# EAGLE board sd2snes19 (EAGLE 4.15), part 1 of 2
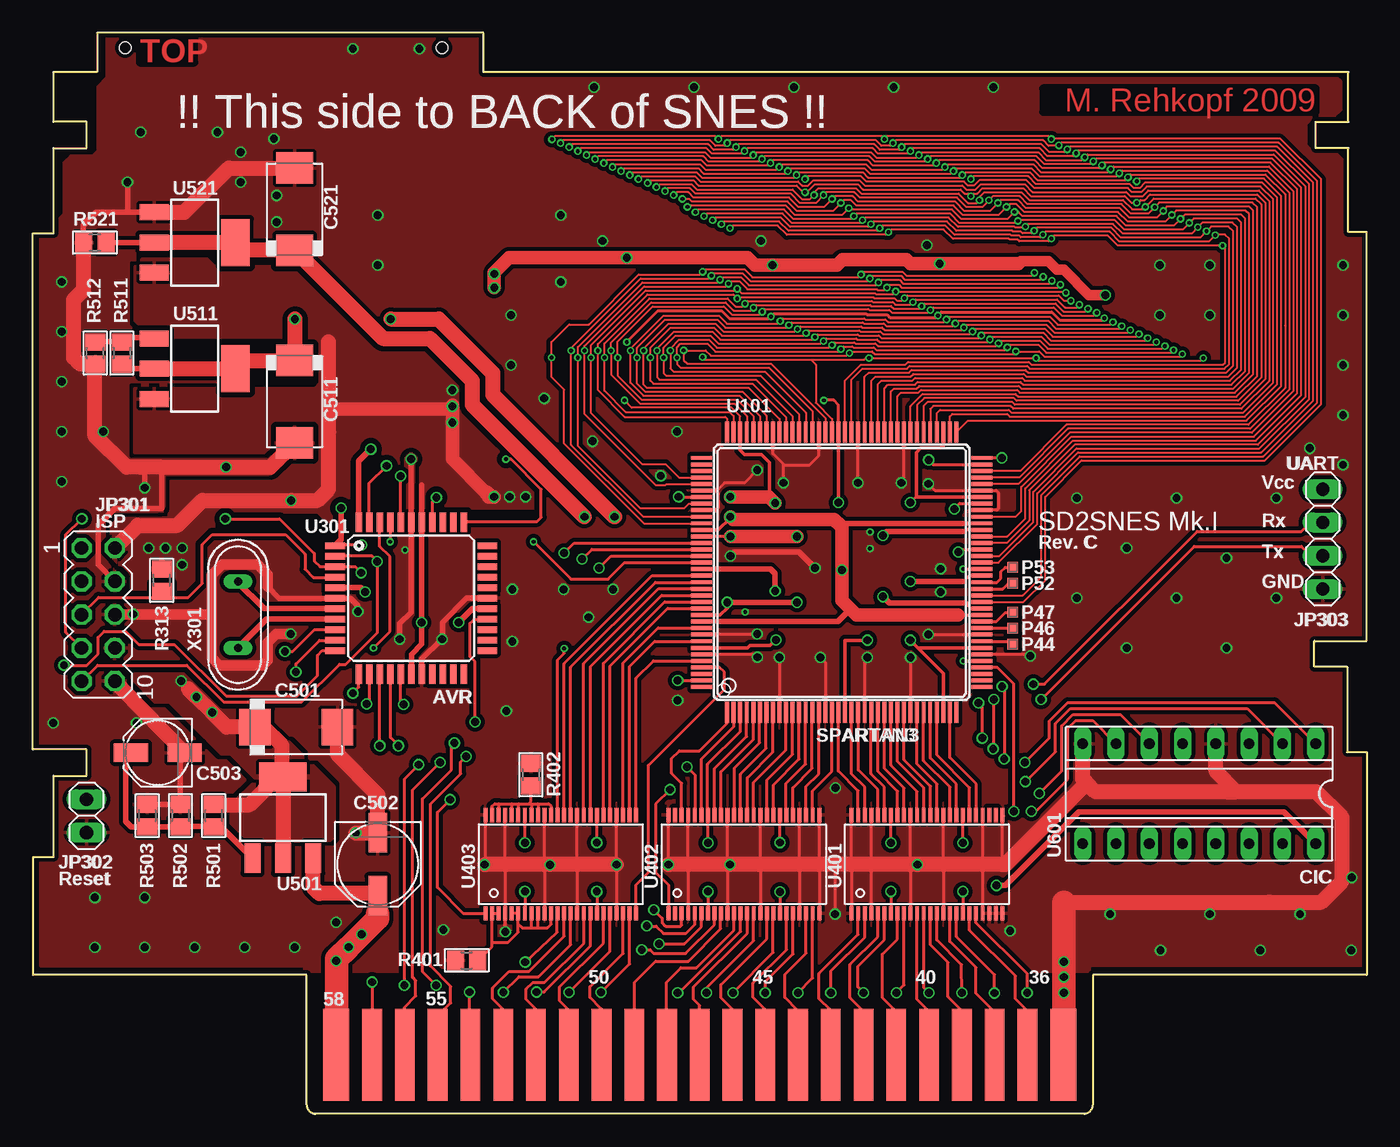
[diagram p4: board, top side]
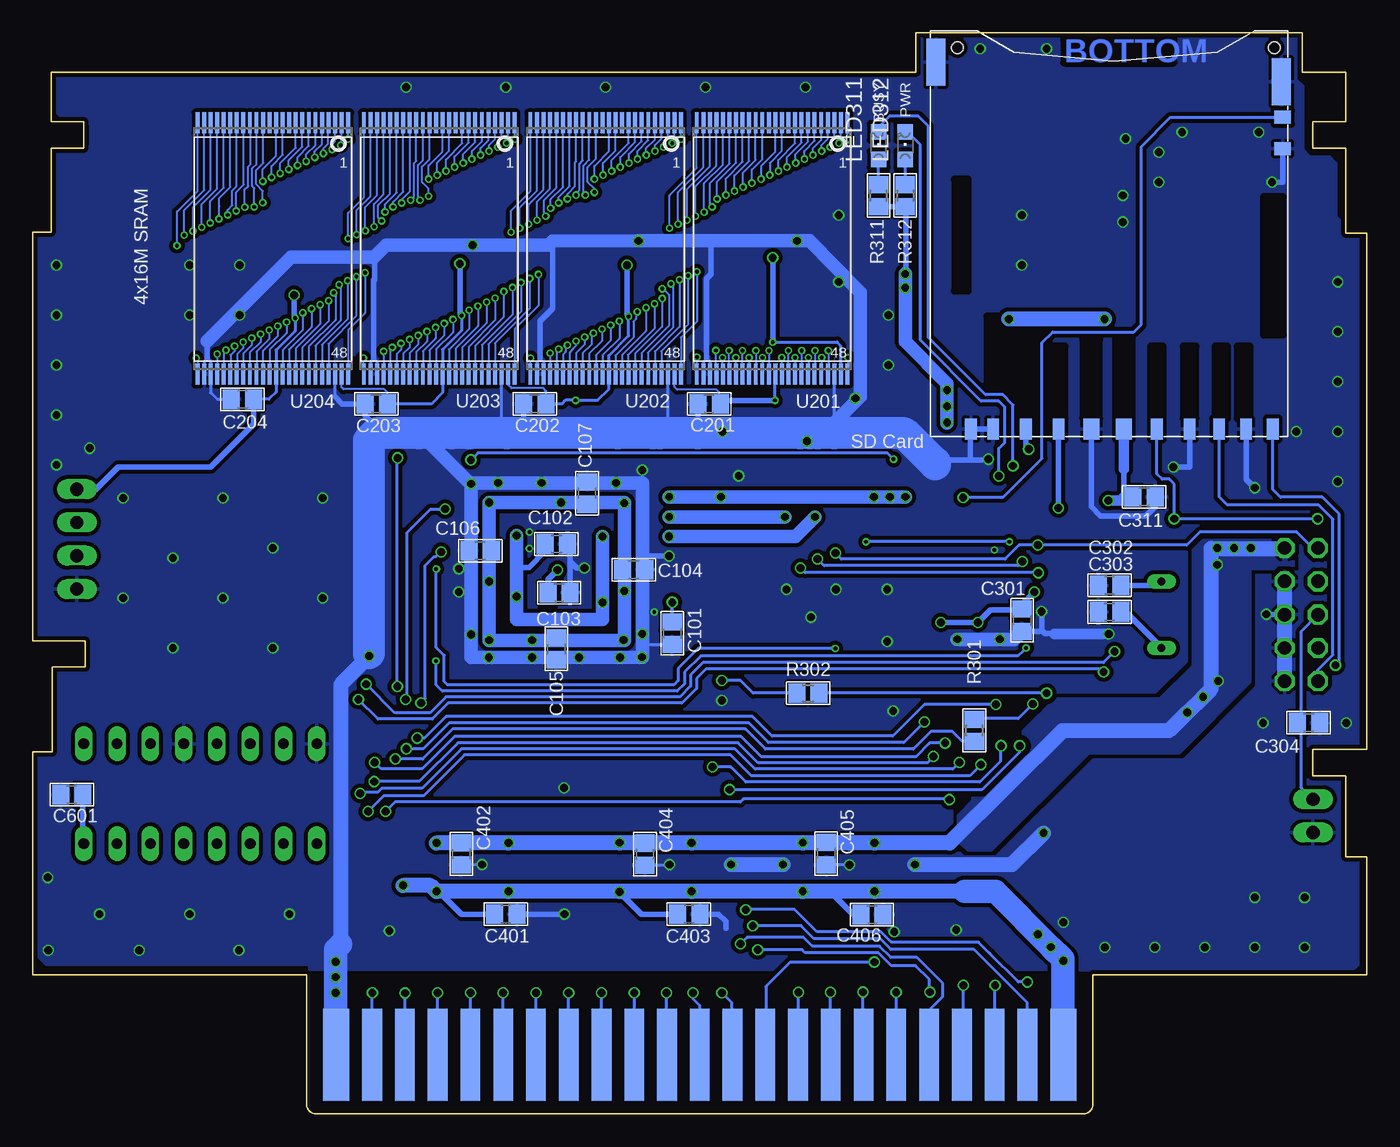
[diagram p5: board, bottom side, seen from below]

Size 101.8 x 82.5 mm. Coordinates in mm from the lower left corner, seen from the top.
Copper layers (1*16): Top 0.035mm / dielectric 1mm / Bottom 0.035mm
Design rules "myBilex DRU": minimum track width 0.15mm, minimum drill 0.3mm, track to track 0.15mm, track to pad 0.15mm, pad to pad 0.15mm, via to via 0.15mm, smd to smd 0.15mm, copper to edge 10mil, drill to drill 8mil, minimum pad ring 10mil, minimum via ring 5mil, stop-mask expansion 4mil, vias tented up to drill 0mil, thermal gap 10mil

## Footprints (pad centres in the part's own frame; a part is rotated, then mirrored left to right if it is on the bottom)
C0805 = smd 1.3 x 1.5: 1 -0.85,0; 2 0.85,0
SMC_D = smd 2.4 x 2.8: + -3.15,0; - 3.15,0
PANASONIC_D = smd 3 x 1.4: + 2.4,0; - -2.4,0
PANASONIC_C = smd 2.6 x 1.4: + 2.05,0; - -2.05,0
JAE-SG5S009V1A = smd 0.9 x 1.6: 1 6.875,14.44; 2 4.375,14.44; 5 -3.125,14.44; 6 -5.625,14.44; 7 -7.875,14.44; 8 -9.925,14.44; 9 9.375,14.44; CARD_DET1 -11.975,14.44; CARD_DET2 11.075,14.44 | smd 1.2 x 1.6: 3 1.875,14.44; 4 -0.6,14.44 | smd 1.45 x 3.6: GND -12.625,-12.06; GND@1 13.725,-13.56 | smd 1.25 x 1: WP_1 -12.725,-9.36; WP_2 -12.725,-6.96 | hole 0.9: -12.1,-14.66; 12.1,-14.66
MA05-2 = drill 1.016 octagon: 1 -5.08,-1.27; 2 -5.08,1.27; 3 -2.54,-1.27; 4 -2.54,1.27; 5 0,-1.27; 6 0,1.27; 7 2.54,-1.27; 8 2.54,1.27; 9 5.08,-1.27; 10 5.08,1.27
1X02 = drill 1.016 long: 1 -1.27,0; 2 1.27,0
1X04 = drill 1.016 long: 1 -3.81,0; 2 -1.27,0; 3 1.27,0; 4 3.81,0
CHIPLED_0805 = smd 1.2 x 1.2: A 0,-1.05; C 0,1.05
SMD08S = smd 0.8 x 0.8: PAD 0,0
R0805 = smd 1.3 x 1.5: 1 -0.85,0; 2 0.85,0
TQ144 = smd 1.6 x 0.3: P1 -10.7,8.75; P2 -10.7,8.25; P3 -10.7,7.75; P4 -10.7,7.25; P5 -10.7,6.75; P6 -10.7,6.25; P7 -10.7,5.75; P8 -10.7,5.25; P9 -10.7,4.75; P10 -10.7,4.25; P11 -10.7,3.75; P12 -10.7,3.25; P13 -10.7,2.75; P14 -10.7,2.25; P15 -10.7,1.75; P16 -10.7,1.25; P17 -10.7,0.75; P18 -10.7,0.25; P19 -10.7,-0.25; P20 -10.7,-0.75; P21 -10.7,-1.25; P22 -10.7,-1.75; P23 -10.7,-2.25; P24 -10.7,-2.75; P25 -10.7,-3.25; P26 -10.7,-3.75; P27 -10.7,-4.25; P28 -10.7,-4.75; P29 -10.7,-5.25; P30 -10.7,-5.75; P31 -10.7,-6.25; P32 -10.7,-6.75; P33 -10.7,-7.25; P34 -10.7,-7.75; P35 -10.7,-8.25; P36 -10.7,-8.75; P73 10.7,-8.75; P74 10.7,-8.25; P75 10.7,-7.75; P76 10.7,-7.25; P77 10.7,-6.75; P78 10.7,-6.25; P79 10.7,-5.75; P80 10.7,-5.25; P81 10.7,-4.75; P82 10.7,-4.25; P83 10.7,-3.75; P84 10.7,-3.25; P85 10.7,-2.75; P86 10.7,-2.25; P87 10.7,-1.75; P88 10.7,-1.25; P89 10.7,-0.75; P90 10.7,-0.25; P91 10.7,0.25; P92 10.7,0.75; P93 10.7,1.25; P94 10.7,1.75; P95 10.7,2.25; P96 10.7,2.75; P97 10.7,3.25; P98 10.7,3.75; P99 10.7,4.25; P100 10.7,4.75; P101 10.7,5.25; P102 10.7,5.75; P103 10.7,6.25; P104 10.7,6.75; P105 10.7,7.25; P106 10.7,7.75; P107 10.7,8.25; P108 10.7,8.75 | smd 0.3 x 1.6: P37 -8.75,-10.7; P38 -8.25,-10.7; P39 -7.75,-10.7; P40 -7.25,-10.7; P41 -6.75,-10.7; P42 -6.25,-10.7; P43 -5.75,-10.7; P44 -5.25,-10.7; P45 -4.75,-10.7; P46 -4.25,-10.7; P47 -3.75,-10.7; P48 -3.25,-10.7; P49 -2.75,-10.7; P50 -2.25,-10.7; P51 -1.75,-10.7; P52 -1.25,-10.7; P53 -0.75,-10.7; P54 -0.25,-10.7; P55 0.25,-10.7; P56 0.75,-10.7; P57 1.25,-10.7; P58 1.75,-10.7; P59 2.25,-10.7; P60 2.75,-10.7; P61 3.25,-10.7; P62 3.75,-10.7; P63 4.25,-10.7; P64 4.75,-10.7; P65 5.25,-10.7; P66 5.75,-10.7; P67 6.25,-10.7; P68 6.75,-10.7; P69 7.25,-10.7; P70 7.75,-10.7; P71 8.25,-10.7; P72 8.75,-10.7; P109 8.75,10.7; P110 8.25,10.7; P111 7.75,10.7; P112 7.25,10.7; P113 6.75,10.7; P114 6.25,10.7; P115 5.75,10.7; P116 5.25,10.7; P117 4.75,10.7; P118 4.25,10.7; P119 3.75,10.7; P120 3.25,10.7; P121 2.75,10.7; P122 2.25,10.7; P123 1.75,10.7; P124 1.25,10.7; P125 0.75,10.7; P126 0.25,10.7; P127 -0.25,10.7; P128 -0.75,10.7; P129 -1.25,10.7; P130 -1.75,10.7; P131 -2.25,10.7; P132 -2.75,10.7; P133 -3.25,10.7; P134 -3.75,10.7; P135 -4.25,10.7; P136 -4.75,10.7; P137 -5.25,10.7; P138 -5.75,10.7; P139 -6.25,10.7; P140 -6.75,10.7; P141 -7.25,10.7; P142 -7.75,10.7; P143 -8.25,10.7; P144 -8.75,10.7
TSOP48 = smd 0.3 x 1.6: 1 -5.75,-9.6; 2 -5.25,-9.6; 3 -4.75,-9.6; 4 -4.25,-9.6; 5 -3.75,-9.6; 6 -3.25,-9.6; 7 -2.75,-9.6; 8 -2.25,-9.6; 9 -1.75,-9.6; 10 -1.25,-9.6; 11 -0.75,-9.6; 12 -0.25,-9.6; 13 0.25,-9.6; 14 0.75,-9.6; 15 1.25,-9.6; 16 1.75,-9.6; 17 2.25,-9.6; 18 2.75,-9.6; 19 3.25,-9.6; 20 3.75,-9.6; 21 4.25,-9.6; 22 4.75,-9.6; 23 5.25,-9.6; 24 5.75,-9.6; 25 5.75,9.6; 26 5.25,9.6; 27 4.75,9.6; 28 4.25,9.6; 29 3.75,9.6; 30 3.25,9.6; 31 2.75,9.6; 32 2.25,9.6; 33 1.75,9.6; 34 1.25,9.6; 35 0.75,9.6; 36 0.25,9.6; 37 -0.25,9.6; 38 -0.75,9.6; 39 -1.25,9.6; 40 -1.75,9.6; 41 -2.25,9.6; 42 -2.75,9.6; 43 -3.25,9.6; 44 -3.75,9.6; 45 -4.25,9.6; 46 -4.75,9.6; 47 -5.25,9.6; 48 -5.75,9.6
TQFP44 = smd 1.5 x 0.5: 1 -5.8,4; 2 -5.8,3.2; 3 -5.8,2.4; 4 -5.8,1.6; 5 -5.8,0.8; 6 -5.8,0; 7 -5.8,-0.8; 8 -5.8,-1.6; 9 -5.8,-2.4; 10 -5.8,-3.2; 11 -5.8,-4; 23 5.8,-4; 24 5.8,-3.2; 25 5.8,-2.4; 26 5.8,-1.6; 27 5.8,-0.8; 28 5.8,0; 29 5.8,0.8; 30 5.8,1.6; 31 5.8,2.4; 32 5.8,3.2; 33 5.8,4 | smd 0.5 x 1.5: 12 -4,-5.8; 13 -3.2,-5.8; 14 -2.4,-5.8; 15 -1.6,-5.8; 16 -0.8,-5.8; 17 0,-5.8; 18 0.8,-5.8; 19 1.6,-5.8; 20 2.4,-5.8; 21 3.2,-5.8; 22 4,-5.8; 34 4,5.8; 35 3.2,5.8; 36 2.4,5.8; 37 1.6,5.8; 38 0.8,5.8; 39 0,5.8; 40 -0.8,5.8; 41 -1.6,5.8; 42 -2.4,5.8; 43 -3.2,5.8; 44 -4,5.8
TSSOP48 = smd 0.3 x 1.1: 1 -5.75,-3.75; 2 -5.25,-3.75; 3 -4.75,-3.75; 4 -4.25,-3.75; 5 -3.75,-3.75; 6 -3.25,-3.75; 7 -2.75,-3.75; 8 -2.25,-3.75; 9 -1.75,-3.75; 10 -1.25,-3.75; 11 -0.75,-3.75; 12 -0.25,-3.75; 13 0.25,-3.75; 14 0.75,-3.75; 15 1.25,-3.75; 16 1.75,-3.75; 17 2.25,-3.75; 18 2.75,-3.75; 19 3.25,-3.75; 20 3.75,-3.75; 21 4.25,-3.75; 22 4.75,-3.75; 23 5.25,-3.75; 24 5.75,-3.75; 25 5.75,3.75; 26 5.25,3.75; 27 4.75,3.75; 28 4.25,3.75; 29 3.75,3.75; 30 3.25,3.75; 31 2.75,3.75; 32 2.25,3.75; 33 1.75,3.75; 34 1.25,3.75; 35 0.75,3.75; 36 0.25,3.75; 37 -0.25,3.75; 38 -0.75,3.75; 39 -1.25,3.75; 40 -1.75,3.75; 41 -2.25,3.75; 42 -2.75,3.75; 43 -3.25,3.75; 44 -3.75,3.75; 45 -4.25,3.75; 46 -4.75,3.75; 47 -5.25,3.75; 48 -5.75,3.75
SOT223 = smd 1.219 x 2.235: 1 -2.311,-3.099; 2 0,-3.099; 3 2.311,-3.099 | smd 3.6 x 2.2: TAB 0,3.099
SOCKED-16 = drill 0.813 long: 1 -8.89,-3.81; 2 -6.35,-3.81; 3 -3.81,-3.81; 4 -1.27,-3.81; 5 1.27,-3.81; 6 3.81,-3.81; 7 6.35,-3.81; 8 8.89,-3.81; 9 8.89,3.81; 10 6.35,3.81; 11 3.81,3.81; 12 1.27,3.81; 13 -1.27,3.81; 14 -3.81,3.81; 15 -6.35,3.81; 16 -8.89,3.81
SNESCART = smd 2 x 7: 5 -27.75,-0.5; 27 27.75,-0.5 | smd 1.5 x 7: 6 -25,-0.5; 7 -22.5,-0.5; 8 -20,-0.5; 9 -17.5,-0.5; 10 -15,-0.5; 11 -12.5,-0.5; 12 -10,-0.5; 13 -7.5,-0.5; 14 -5,-0.5; 15 -2.5,-0.5; 16 0,-0.5; 17 2.5,-0.5; 18 5,-0.5; 19 7.5,-0.5; 20 10,-0.5; 21 12.5,-0.5; 22 15,-0.5; 23 17.5,-0.5; 24 20,-0.5; 25 22.5,-0.5; 26 25,-0.5 | smd 2 x 7 bottom: 36 -27.75,-0.5; 58 27.75,-0.5 | smd 1.5 x 7 bottom: 37 -25,-0.5; 38 -22.5,-0.5; 39 -20,-0.5; 40 -17.5,-0.5; 41 -15,-0.5; 42 -12.5,-0.5; 43 -10,-0.5; 44 -7.5,-0.5; 45 -5,-0.5; 46 -2.5,-0.5; 47 0,-0.5; 48 2.5,-0.5; 49 5,-0.5; 50 7.5,-0.5; 51 10,-0.5; 52 12.5,-0.5; 53 15,-0.5; 54 17.5,-0.5; 55 20,-0.5; 56 22.5,-0.5; 57 25,-0.5
QS = drill 0.61 long: 1 -2.54,0; 2 2.54,0

## Placement (x,y rotation side)
C101  100n  [C0805]  53,36.67 270 bottom
C102  100n  [C0805]  61.84,43.48 0 bottom
C103  100n  [C0805]  61.64,39.77 0 bottom
C104  100n  [C0805]  55.95,41.52 0 bottom
C105  100n  [C0805]  61.84,35.48 270 bottom
C106  100n  [C0805]  67.66,42.97 180 bottom
C107  100n  [C0805]  59.5,47.36 90 bottom
C201  100n  [C0805]  50.18,54.17 180 bottom
C202  100n  [C0805]  63.49,54.17 180 bottom
C203  100n  [C0805]  75.58,54.17 180 bottom
C204  100n  [C0805]  85.79,54.53 180 bottom
C301  100n  [C0805]  26.3,37.66 270 bottom
C302  22p  [C0805]  19.62,40.33 0 bottom
C303  22p  [C0805]  19.62,38.3 0 bottom
C304  100n  [C0805]  4.44,29.84 0 bottom
C311  100n  [C0805]  16.98,47.08 0 bottom
C401  100n  [C0805]  65.7,15.23 0 bottom
C402  100n  [C0805]  69.1,19.83 270 bottom
C403  100n  [C0805]  51.73,15.23 0 bottom
C404  100n  [C0805]  55.08,19.8 270 bottom
C405  100n  [C0805]  41.24,19.86 90 bottom
C406  100n  [C0805]  37.76,15.21 0 bottom
C501  T_100u  [SMC_D]  20.11,29.51 0 top
C502  100u/16V  [PANASONIC_D]  26.33,19.04 270 top
C503  22u/16V  [PANASONIC_C]  9.54,27.55 180 top
C511  T_100u  [SMC_D]  19.98,54.35 270 top
C521  T_100u  [SMC_D]  19.98,69.03 90 top
C601  100n  [C0805]  98.82,24.35 180 bottom
J301  JAE-SG5S009V1A  [JAE-SG5S009V1A]  19.14,66.7 180 bottom
JP301  [MA05-2]  4.99,38.09 270 top
JP302  [1X02]  4.11,22.73 270 top
JP303  [1X04]  98.44,43.86 270 top
LED311  RED  [CHIPLED_0805]  37.25,73.88 0 bottom
LED312  GREEN  [CHIPLED_0805]  35.22,73.88 0 bottom
P44  PAD-SMD08S  [SMD08S]  74.79,35.83 0 top
P46  PAD-SMD08S  [SMD08S]  74.79,37.05 0 top
P47  PAD-SMD08S  [SMD08S]  74.79,38.27 0 top
P52  PAD-SMD08S  [SMD08S]  74.79,40.48 0 top
P53  PAD-SMD08S  [SMD08S]  74.79,41.7 0 top
R301  270  [R0805]  29.94,29.25 90 bottom
R302  270  [R0805]  42.64,32.1 0 bottom
R311  100  [R0805]  37.25,70.07 90 bottom
R312  100  [R0805]  35.22,70.07 270 bottom
R313  10k  [R0805]  9.85,40.71 90 top
R401  10k  [R0805]  33.11,11.7 0 top
R402  10k  [R0805]  38.01,25.87 270 top
R501  100  [R0805]  13.81,22.75 90 top
R502  180  [R0805]  11.27,22.75 270 top
R503  2k2  [R0805]  8.73,22.75 270 top
R511  100  [R0805]  6.8,58.06 270 top
R512  100  [R0805]  4.77,58.06 90 top
R521  100  [R0805]  4.74,66.49 0 top
U101  XC3S200TQ144TQ144  [TQ144]  61.74,41.31 90 top
U201  CY62167DV30ZXI  [TSOP48]  45.38,66.03 180 bottom
U202  CY62167DV30ZXI  [TSOP48]  58.08,66.03 180 bottom
U203  CY62167DV30ZXI  [TSOP48]  70.78,66.03 180 bottom
U204  CY62167DV30ZXI  [TSOP48]  83.48,66.03 180 bottom
U301  ATMEGA644-20AU  [TQFP44]  28.88,39.35 0 top
U401  74ALVC164245DGG  [TSSOP48]  68.24,19.04 0 top
U402  74ALVC164245DGG  [TSSOP48]  54.27,19.04 0 top
U403  74ALVC164245DGG  [TSSOP48]  40.3,19.04 0 top
U501  LM1117MPX-ADJ  [SOT223]  19.09,22.6 0 top
U511  LM1117MPX-ADJ  [SOT223]  12.36,56.86 270 top
U521  LM1117MPX-ADJ  [SOT223]  12.36,66.49 270 top
U601  CIC  [SOCKED-16]  89.02,24.43 180 top
U$98  SNESCART  [SNESCART]  50.9,5 0 bottom
X301  12MHz  [QS]  15.66,38.09 90 top

## Tracks (layer width: path | path; a pad name or v marks a point on that pad's centre or on a via)
+1.25V  (via drill 0.6)
  Top 0.229: U101.P121 v53.25,44.06 | v53,39.03 53,38.6 | U101.P49 71.58,38.56 71.16,38.98
  Top 0.254: U101.P133 52.46,38.06 53,38.6 | U101.P61 71.16,44.57 71.03,44.44
  Top 0.406: v58.31,39.03 v53,39.03 | 71.03,44.44 65.19,44.44 v64.89,44.14 | 71.16,38.98 65.37,38.98 v64.89,39.46 | U521.2 R521.2
  Top 1.016: v53.25,44.06 v58.31,44.06
  Top 1.143: 20.01,65.91 20,65.91 C521.+ | C521.+ 19.96,65.91 19.96,65.96 16,65.96 U521.TAB 15.44,66.52 9.28,66.52 U521.2 | C521.+ 19.98,65.98 | 19.95,65.85 19.93,65.85 | C521.+ 19.95,65.85 | 19.95,65.85 20.97,65.85 | C521.+ 20.02,65.88 26.73,59.17 30.32,59.17 33.54,55.95 33.54,54.12 v42.1,45.56
  Bottom 0.229: C101.1 53,37.66 | 64.89,44.11 v64.89,44.14 | 64.89,41.7 64.91,41.7
  Bottom 0.254: v53,39.03 C101.1
  Bottom 0.406: C102.1 62.69,42.93 63.92,41.7 64.89,41.7
  Bottom 1.016: 43.81,44.06 v53.25,44.06 | v58.31,44.06 v58.31,39.03 58.31,37.74 64.89,37.74 v64.89,39.46 64.89,41.7 64.89,44.11 | 43.81,44.06 43.78,44.06 | v42.1,45.56 43.6,44.06 43.81,44.06
+2.5V  (via drill 0.6)
  Top 0.229: v53.23,45.56 53.23,45.48 | U101.P48 70.58,38.06 70.58,38.07 | 61.64,44.87 61.82,45.06
  Top 0.254: U101.P120 52.31,44.56 53.23,45.48 | U101.P134 51.45,37.56 52.27,37.56 | U101.P62 72.46,45.05 | U101.P62 | 71.21,45.05 U101.P62
  Top 0.406: 62.41,38.51 61.46,37.56 52.27,37.56 | 61.76,41.52 61.79,41.52 v61.76,41.5 | R511.2 7.12,56.89 9.19,56.86 | 61.82,45.06 61.84,45.05 71.21,45.05
  Top 1.016: v53.23,45.56 53.43,45.36 61.15,45.36 61.64,44.87 61.76,44.75 61.76,41.52 61.76,39.16 62.41,38.51 62.86,38.07 70.58,38.07 70.6,38.07
  Top 1.143: U511.2 9.19,56.86 U511.TAB 16.07,57.47 20.01,57.47 C511.+ 20.01,57.52 v20.01,60.65 | v27.31,60.65 30.98,60.65 35.09,56.53 35.09,54.88 44.42,45.56 v44.39,45.56
  Bottom 0.406: C103.1 62.49,40.77 v61.76,41.5
  Bottom 1.016: v44.39,45.56 v53.23,45.56
  Bottom 1.143: v20.01,60.65 v27.31,60.65
+3V3  (via drill 0.3, 0.6)
  Top 0.152: v45.15,54.45 45.71,53.89 53.33,53.89 53.99,53.24 U101.P106
  Top 0.229: U101.P3 53.99,30.62 | U101.P3 | U101.P3 53.99,29.18 51.5,26.69 51.5,22.81 U402.42 51.52,20.75 v51.53,20.67 | U403.42 37.55,20.75 v37.56,20.67 | U403.31 v43.05,20.7 v43.04,20.69 | U402.31 v57.02,20.7 v57.01,20.69 | U401.31 v70.98,20.67 | U401.42 v65.5,20.67 | 61.99,36.14 61.99,36.13 | v66.97,36.14 67.54,35.56 | U101.P54 71.49,41.06 71.06,40.63 | v66.97,46.65 67.38,47.06 67.43,47.06 | v61.48,46.65 61.49,46.63 | 56.2,47.06 56.23,47.08 | U101.P115 49.29,47.06 v49.29,47.08 | U101.P91 61.49,52.14 61.48,52.14 61.48,54.09 61.13,54.45 v60.37,54.45 | 56.3,60.83 56.12,60.65 53.2,60.65 52.59,61.26 47.69,61.26 v45.33,58.9 | v56.33,60.85 56.3,60.83 | 56.3,60.83 56.53,61.05 63.62,61.05 63.69,60.98 65.22,60.98 65.42,60.77 68.93,60.77 v69.08,60.93 69.33,61.18 77.77,61.18 78.38,60.57 81.63,60.57 v81.78,60.72
  Top 0.254: U101.P138 54.56,35.56 54.73,35.73 56.28,35.73 v56.71,36.16 | 61.99,36.13 U101.P19 | v63.69,36.14 61.99,36.14 | U101.P34 69.49,33.62 v66.97,36.14 | 67.54,35.56 U101.P43 | U101.P66 67.43,47.06 67.43,50.46 67.76,50.79 69.28,50.79 69.49,51 69.49,51.94 U101.P75 | 61.49,46.63 U101.P91 | U101.P106 53.99,50.64 54.32,50.31 55.62,50.31 56.23,49.7 56.23,47.08 | U101.P126 52.16,41.57
  Top 0.406: v66.97,40.63 71.06,40.63 | v35.2,47.08 35.2,47.11 | 28.9,33.53 28.9,33.24 | 28.9,33.53 U301.17 | 28.9,33.53 28.9,35.07 29.68,35.86 v29.68,37.48 v29.68,37.49 U301.38 29.68,46.5 29.68,48 | U301.5 25.04,40.15 v25.37,39.82 | U301.27 33.57,38.55 v32.5,37.48 | 52.16,41.57 56.3,41.57 56.66,41.22 v56.66,39.9
  Top 0.813: 75.23,64.89 75.4,65.07 77.51,65.07 78.17,64.41 78.68,64.41 80.61,62.48 v81.85,62.48
  Top 1.016: 34.64,47.44 34.67,47.35 34.79,47.08 v35.2,47.08 | v53.23,47.08 56.18,47.08 56.2,47.06 | 56.2,47.06 56.53,46.73 | 56.2,47.06 v56.66,46.6 | v35.22,63.04 v35.22,64.1 35.22,64.2 36.36,65.35 v45.33,65.35 54.55,65.35 55.13,64.76 v56.45,64.76 61.38,64.76 61.79,65.17 66.69,65.17 67,64.89 v69.21,64.89 75.23,64.89 | 22.57,53.79 32.02,53.79 | 32.02,53.79 32.02,54.09 | 34.64,47.34 32.02,49.95 32.02,53.79
  Top 1.143: U501.TAB U501.2 | 13.8,23.59 13.71,23.59 | R501.2 13.8,23.59 | 13.8,23.59 16.55,23.59 18.66,25.7 U501.TAB | JP301.2 7.99,44.9 11.04,44.9 12.94,46.8 v19.73,46.8 21.73,46.8 22.57,47.64 22.57,52.11 | 22.57,52.11 22.57,51.96 | U511.3 | 22.57,52.11 22.57,53.79 22.57,58.9 | U501.TAB 19.02,25.7 19.02,28.1 17.63,29.48 16.98,29.48 C501.+ 14.79,29.51 v13.68,30.62 v12.49,31.82 11.88,32.43 | U501.TAB | 34.64,47.34 34.65,47.35 34.67,47.35
  Bottom 0.152: 45.15,56.48 45.13,56.46 U201.37 | U202.47 52.82,56.4 52.82,55.47 52.62,55.26 49.62,55.26 49.39,55.03 49.39,54.42 49.41,54.41 C201.1 | U203.47 65.53,55.63 65.27,55.36 62.83,55.36 62.63,55.16 62.63,54.17 | U204.47 78.23,55.42 78.1,55.29 74.97,55.29 74.74,55.06 74.74,54.2 74.73,54.18 C203.1
  Bottom 0.229: 43.04,20.67 v43.04,20.69 | 39.51,20.67 39.51,20.72 39.53,20.71 C405.2 | 57.01,20.67 v57.01,20.69 57.04,20.69 57,20.65 C404.1 | C402.1 69.12,20.67 v70.98,20.67 | 56.66,36.19 56.71,36.19 v56.71,36.16 | 66.97,36.24 66.92,36.24 v66.97,36.14 | v66.97,40.63 66.95,40.63 66.81,40.77 C106.1 | v66.97,46.65 66.87,46.63 | 61.46,46.65 61.46,46.63 v61.48,46.65 | 49.24,47.08 49.24,47.06 v49.29,47.08 | 56.66,43.1 56.68,43.1 56.68,42.87 | C104.1 56.68,41.63 56.68,42.87 | 56.66,42.87 56.68,42.87 | 45.15,56.48 v45.15,54.45 45.13,54.42 | v56.33,60.85 56.33,59.38 57.83,57.88 U202.37 57.83,55.31 58.69,54.45 v60.37,54.45 | v45.33,58.9 40.43,58.9 40.15,58.62 40.15,56.43 U201.47 | v69.08,60.93 69.08,59.78 70.53,58.33 U203.37 70.53,55.03 71.36,54.17 C203.1 | U204.37 83.23,58.29 81.78,59.73 v81.78,60.72 | 49.33,54.37 46.85,54.42 | 49.33,54.37 C201.1 | 49.39,54.42 49.33,54.37 | U204.37 83.25,56.41 83.23,56.38 | C204.1 83.79,54.53 83.23,55.09 83.23,56.33 83.25,56.36 83.23,56.38 U204.37 | 62.63,54.17 61.41,54.17 61.13,54.45 v60.37,54.45 | v60.37,54.45 60.32,54.45 | 35.17,69.21 37.25,69.21 | v35.22,64.1 35.17,64.15
  Bottom 0.406: v25.37,39.82 25.37,39.85 26.33,38.88 26.33,38.49 | 26.33,38.45 26.33,38.4 | 26.33,38.49 26.33,38.45 | 26.33,38.49 C301.1 | 26.33,38.45 28.72,38.45 v29.68,37.48 v32.5,37.48 | 45.13,54.42 49.39,54.42 | 62.63,54.17 C202.1 | 81.85,62.45 81.85,60.72 v81.78,60.72 | v69.21,64.89 69.21,61.05 v69.08,60.93 | v56.45,64.76 56.45,60.98 v56.33,60.85 | v45.33,65.35 v45.33,58.9 | C204.1 84.95,54.51 84.95,52.65 88.23,49.37 95.29,49.37 97.04,47.62 98.47,47.62 98.47,47.64 JP303.1 | 18.53,47.08 18.56,47.08 | 18.53,47.08 C311.1 | 18.53,47.08 18.53,49.22 | R312.2 R311.1 37.25,69.21 | 35.17,64.15 35.17,69.21
  Bottom 0.813: v19.73,46.8 18.53,46.8 18.53,47.08 | 18.53,49.22 J301.4
  Bottom 1.016: v35.2,47.08 v36.39,47.08 v37.61,47.08 49.24,47.08 v53.23,47.08 | v56.66,46.6 56.66,43.1 56.66,42.87 v56.66,39.9 56.66,36.19 56.66,36.14 60.47,36.14 | 60.47,36.14 v63.69,36.14 v66.97,36.14 66.97,36.24 v66.97,40.63 v66.97,46.65 61.46,46.65 60.72,46.65 | 60.72,46.65 56.63,46.65 | C107.1 59.5,46.65 60.72,46.65 | C105.1 61.84,36.14 60.47,36.14 | v35.22,64.1 v35.22,63.04 35.22,58.92 32.02,55.72 32.02,55.06 | 32.02,55.36 v32.02,55.24 32.02,55.06 | v32.02,52.75 v32.02,53.99 32.02,54.3 | 32.02,55.06 32.02,54.3 | v32.02,52.75 32.02,52.7 | 32.02,54.3 v32.02,52.75
  Bottom 1.143: v70.98,20.67 v65.5,20.67 57.01,20.67 v51.53,20.67 43.04,20.67 39.51,20.67 v37.56,20.67 31.84,20.67 23.23,29.23 15.1,29.23 v13.68,30.62 v12.49,31.82 11.88,32.43 11.88,43.15 6.24,43.15 | 6.24,43.15 6.16,43.15 | 6.24,43.15 JP301.2
  other vias: 11.32,33.04 10.12,43.17 11.39,41.9 11.39,43.17 8.85,43.17
  pour Top (isolate 0.406): 27.09,45.26 28.08,46.25 39.21,46.25 39.36,46.4 39.36,47.57 38.83,48.1 38.01,48.1 32.63,53.48 32.63,58.13 31.33,59.43 26.76,59.43 21.96,64.23 21.55,64.66 13.91,64.66 13.35,65.22 8.32,65.22 7.79,64.69 7.79,60.52 9.03,59.28 20.67,59.28 21.05,58.89 21.91,58.06 21.91,55.75 21.5,55.34 7.74,55.34 7.74,50.46 8.02,50.18 17.44,50.18 18.41,51.15 21.2,51.15 21.76,50.59 21.76,45.89 22.39,45.26
  pour Bottom (isolate 0.406): 29.96,25.29 23.69,31.56 15.71,31.56 13.17,34.1 13.17,43.15 12.39,43.93 5.68,43.93 5.65,42.99 5.68,42.18 5.68,41.67 8.98,41.67 8.98,33.01 14.39,27.6 21.3,27.6 28.97,19.93 30.14,19.93 31.08,20.87 31.08,22.75 29.96,23.87
  pour Top (isolate 0.406): 10.51,31.51 14.47,27.55 15.18,27.55 17.24,25.49 15.23,23.49 15.23,21.96 16.3,20.9 22.57,20.9 22.93,21.23 22.93,24.91 19.5,28.31 17.74,28.31 17.03,29.02 17.03,31.01 16.65,31.39 14.47,31.39 12.36,33.49 7.76,33.49 7.41,33.14 7.41,31.51
  pour Top (isolate 0.406): 6.06,42.59 6.67,41.95 6.92,41.95 7.53,41.34 7.53,40.07 7.66,39.95 11.78,39.95 12.59,40.76 12.59,43.4 14.72,45.53 14.95,45.53 15.43,46.02 22.72,46.02 22.72,49.73 19.68,49.73 18.71,48.76 11.06,48.76 10.51,48.2 10.51,45.38 6.34,45.38 6.06,45.1
+5V  (via drill 0.6)
  Top 0.229: U403.18 43.05,16.93 v43.04,16.96 | U403.7 37.55,16.9 v37.56,16.96 | U402.18 v57.02,16.93 v57.01,16.93 | U402.7 51.52,16.9 v51.53,16.96 | 65.49,16.9 v65.5,16.96 U401.7 | U401.18 70.99,16.9 v70.98,16.96
  Top 0.406: v73.55,17.42 74.23,17.42 79.85,23.03 95.47,23.03 97.91,20.59 U601.16 | U$98.27 23.16,4.44 | U$98.27 | v23.16,11.68 U$98.27
  Top 1.143: 26.31,16.67 26.31,16.81 21.86,16.81 21.4,17.26 U501.3 | 26.31,16.67 C502.+ | 26.31,15.26 26.31,15.97 | 26.31,15.97 26.31,16.67 | 26.31,15.97 26.33,15.97 26.3,15.94 | U501.3
  Top 1.778: 26.31,15.26 26.31,14.93 v24.1,12.72 23.21,11.83 23.21,10.1 | 23.17,4.5 23.21,4.46 23.21,10.1 | 23.21,10.1 23.21,10.13
  Bottom 0.229: 57.01,16.99 57.01,16.96 v57.01,16.93 | v70.98,16.96 70.98,16.99 | 43.07,16.96 43.04,16.93
  Bottom 0.406: 43.04,16.93 40.91,16.93 39.21,15.23 38.6,15.23 38.61,15.22 C406.1 | v70.98,16.96 70.98,16.83 70.69,16.83 69.08,15.23 C401.1 | v57.01,16.93 57.01,16.88 55.36,15.23 C403.1 | 24.04,12.72 24.02,12.69 | v24.1,12.72 24.04,12.72 | v25.09,13.68 25.01,13.68 24.04,12.72 | 23.21,11.7 23.16,11.7 v23.16,11.68 U$98.27 | U$98.27 23.16,4.49 | U$98.27 | U601.16 97.91,20.67 97.97,20.73 C601.1
  Bottom 1.143: 30.67,16.96 v37.56,16.96 v43.04,16.96 43.07,16.96 v51.53,16.96 57.01,16.96 v65.5,16.96 v70.98,16.96 71.44,17.42 v73.55,17.42
  Bottom 1.778: 30.67,16.96 28.34,16.96 v24.1,12.72 23.21,11.83 23.21,11.7 23.21,4.23 23.15,4.29
BANK0_CE  (via drill 0.3)
  Top 0.152: v46.22,71.34 46.42,71.54 50.54,71.54 50.94,71.14 58.41,71.14 58.72,70.83 59.17,70.83 59.58,71.24 63.08,71.24 63.49,70.83 70.93,70.83 71.24,70.53 71.95,70.53 72.36,70.93 75.71,70.93 76.29,70.35 83.46,70.35 83.76,70.05 84.73,70.05 85.13,70.45 93.56,70.45 94.35,69.66 94.35,55.92 92.24,53.82 74.82,53.82 74.62,54.02 68.72,54.02 68.49,53.78 U101.P77
  Bottom 0.152: U201.12 45.13,73.42 46.22,72.33 v46.22,71.34
BANK1_CE  (via drill 0.3)
  Top 0.152: v58.94,71.34 59.15,71.54 63.21,71.54 63.62,71.14 71.06,71.14 71.36,70.83 71.82,70.83 72.23,71.24 75.84,71.24 76.42,70.66 83.58,70.66 83.89,70.35 84.6,70.35 85,70.76 93.69,70.76 94.66,69.79 94.66,55.8 92.37,53.51 74.69,53.51 74.49,53.71 69.23,53.71 68.99,53.47 U101.P76
  Bottom 0.152: U202.12 57.83,73.45 58.94,72.33 v58.94,71.34
BANK2_CE  (via drill 0.3)
  Top 0.152: v71.59,71.34 71.8,71.54 75.96,71.54 76.55,70.96 83.71,70.96 84.01,70.66 84.47,70.66 84.88,71.06 93.82,71.06 94.96,69.92 94.96,55.67 92.5,53.21 74.57,53.21 74.36,53.41 70.17,53.41 69.99,53.22 U101.P74
  Bottom 0.152: U203.12 70.53,73.42 71.59,72.36 v71.59,71.34
BANK3_CE  (via drill 0.3)
  Top 0.152: v84.24,71.16 84.45,71.37 93.95,71.37 95.27,70.05 95.27,55.54 92.62,52.9 71.36,52.9 U101.P73
  Bottom 0.152: U204.12 83.23,73.12 84.24,72.1 v84.24,71.16
CCLK  (via drill 0.6)
  Top 0.229: U101.P72 | 72.48,50.06 U101.P72 | v74.13,27.07 74.18,27.12 74.18,32.4 v73.98,32.61 | U101.P72 v73.96,50.06
  Bottom 0.229: 29.93,28.42 29.89,28.42 | R301.1 29.93,28.42 | 29.93,28.42 30.85,28.42 31.61,29.18 33.26,29.18 34.61,27.83 45.89,27.83 47.41,29.35 69.76,29.35 72.05,27.07 v74.13,27.07 | v73.96,50.06 73.98,50.06 v73.98,32.61
CCLK_AVR  (via drill 0.6)
  Top 0.229: U301.13 25.7,33.53 25.7,31.51 v25.47,31.29
  Bottom 0.229: 30,30.17 30.06,30.17 | 30,30.17 R301.2 | v25.47,31.29 26.58,30.17 30,30.17
CLKIN  (via drill 0.3)
  Top 0.229: U301.41 27.27,45.14 v27.27,43.66 | v38.22,43.66 41.06,40.81 43.91,40.81 45.15,42.05 U101.P125 | U101.P125 51.07,42.05 | U101.P125
  Bottom 0.229: v27.27,43.66 v38.22,43.66
DIN/FPGA_SS  (via drill 0.6)
  Top 0.229: U301.26 34.67,37.74 33.67,37.74 33.37,37.43 33.37,34.89 33.75,34.51 v33.75,29.91 | U101.P65 72.43,46.58 70.73,46.58 70.3,46.14 v70.32,46.14 | v73.3,27.86 73.35,27.91 v73.35,31.62
  Bottom 0.229: v33.75,29.91 35.32,28.34 45.66,28.34 47.16,29.84 70.02,29.84 72,27.86 v73.3,27.86 73.32,27.86 | 70.3,46.14 v70.32,46.14 71.44,46.14 73.22,44.37 73.22,31.74 v73.35,31.62
DONE  (via drill 0.3, 0.6)
  Top 0.229: 72.43,49.57 U101.P71 68.71,49.56 v68.37,49.9 | U301.34 32.94,45.2 38.5,45.2 38.8,45.51 38.8,47.64 36.49,49.95 v36.11,49.95
  Bottom 0.229: v68.37,49.9 67.83,50.44 36.59,50.44 v36.11,49.95
FPGA_INT  (via drill 0.3)
  Top 0.229: U301.42 26.48,43.3 27.27,42.51 27.27,36.82 v26,35.55 | U101.P41 72.48,34.56 v71.03,34.56
  Bottom 0.229: 26.18,35.37 26.2,35.35 | 26.18,35.37 v26,35.55 | 26.18,35.37 26.61,34.94 50.82,34.94 52.06,33.7 52.06,32.81 52.62,32.25 70.55,32.25 71.03,32.73 v71.03,34.56
FPGA_P44
  Top 0.229: 74.79,35.81 74.82,35.78 | 74.79,35.81 P44.PAD | U101.P44 74.54,36.06 74.79,35.81
FPGA_P46
  Top 0.229: P46.PAD 74.82,37.05 74.81,37.06 U101.P46
FPGA_P47
  Top 0.229: U101.P47 73.53,37.56 74.21,38.24 74.79,38.24 P47.PAD
FPGA_P52
  Top 0.229: P52.PAD 74.44,40.48 74.02,40.06 U101.P52
FPGA_P53
  Top 0.229: U101.P53 73.58,40.56 73.88,40.86 73.88,41.37 74.21,41.7 P53.PAD
GND  (via drill 0.3, 0.6)
  Top 0.229: 41.55,19.02 41.55,18.99 | U403.34 41.55,19 41.55,18.99 | 39.06,19.04 39.06,19.02 39.06,18.99 39.44,18.99 | 39.06,19.04 39.06,19.07 39.05,19.07 U403.39 | 36.05,19.07 36.05,19.03 36.06,19.02 | 36.05,19.07 U403.45 | U403.48 34.55,19.03 34.53,19.02 | U403.4 | 39.06,19.04 39.11,18.99 39.44,18.99 | U403.10 39.05,19.04 39.06,19.04 | U403.15 41.55,18.99 | 41.55,18.99 41.27,18.99 41.19,19.07 39.51,19.07 39.44,18.99 | 39.44,18.99 v39.49,18.99 | v44.54,19.02 44.54,19.09 | U403.21 44.55,19.09 44.54,19.09 | U403.28 44.55,19.1 44.54,19.09 | 36.05,19.07 36.06,19.07 | 53.18,19.02 53.18,19.04 v53.2,19.02 | U402.39 53.02,19.02 53.03,19.02 | U402.48 48.52,19.03 48.53,19.02 | U402.45 50.02,19 50.03,18.99 50.03,19.02 50.02,19.01 U402.4 | U402.34 55.52,19.1 55.44,19.02 55.16,19.02 55.08,18.94 53.25,18.94 53.2,18.99 | U402.28 58.52,19.03 58.51,19.02 58.51,18.99 58.52,18.98 U402.21 | U402.25 60.02,19.03 60.01,19.02 60.02,19.01 U402.24 | U401.48 62.49,19.03 62.5,19.02 | 64,19.02 64,19.07 63.99,19.08 U401.45 | 67,19.02 67,19.09 66.99,19.1 U401.39 | 69.49,19.07 69.49,19.04 69.51,19.02 | 69.49,19.07 U401.34 | U401.28 72.49,19.03 72.48,19.02 72.48,16.4 | U401.25 73.99,19.03 73.98,19.02 | v53.2,19.02 53.2,18.99 | U402.10 53.02,18.81 53.2,18.99 | U402.15 55.52,18.66 55.08,19.09 53.23,19.09 53.15,19.02 v53.2,19.02 | 63.97,19.02 63.97,15.54 | 69.49,19.07 | 72.48,16.4 72.48,16.35 | 67.48,19.02 67.48,19.04 v67.5,19.02 67.48,18.99 | U403.4 | 36.08,19.02 36.08,18.99 36.06,18.97 | U403.4 | U101.P114 51.06,47.54 52.14,47.54 | 52.14,47.54 52.16,47.54 52.77,48.15 54.32,48.15 v55.29,49.12 | U101.P117 52.13,46.06 52.29,46.22 52.29,47.39 52.14,47.54
  Top 0.229: U101.P139 51.03,35.06 51.02,35.07 55.08,35.07 v55.31,34.84 | U101.P136 55.28,36.56 v55.29,36.62 | U101.P16 60.49,34.44 v60.11,34.82 | U101.P22 63.49,34.56 v63.69,34.82 | U101.P29 66.99,34.81 v67,34.82 | U101.P9 v56.99,34.81 v56.99,34.82 | U101.P42 76.13,35.06 v76.14,34.94 | U101.P45 v68.35,36.56 v68.34,36.57 | U101.P101 56.49,50.38 57.29,49.57 57.29,49.52 | v57.29,48.15 57.29,49.52 | U101.P94 59.99,50.23 59.27,49.52 57.29,49.52 | U101.P88 v62.98,48.15 | U101.P81 66.49,48.15 v66.28,48.15 | 72.41,47.56 68.85,47.56 68.85,47.57 | 72.41,47.56 U101.P67 73.52,47.57 73.68,47.41 73.68,46.17 73.57,46.06 U101.P64 | 72.41,47.56 72.41,47.57 68.85,47.57 | v68.34,48.07 68.85,47.57 | 36.06,19.02 36.06,19.04 | 36.06,19.02 v36.06,13.89 36.06,15.28 U403.4 | 78.68,4.54 78.65,4.54 | 62.47,19.02 62.47,18.99 62.49,18.98 U401.1 | 61.23,19.02 v61.23,15.23 | 63.97,15.54 63.97,15.31 U401.4 | 63.97,15.54 63.97,15.06 | U401.21 72.48,16.4 | U401.15 69.49,18.99 67.48,18.99 | 67.48,18.99 67.35,18.99 | U401.10 66.97,15.31 66.97,19.02
  Top 0.406: 11.24,23.58 11.24,23.54 | 11.24,23.58 R502.1 11.25,23.61 8.71,23.61 | C503.- 11.24,26.76 11.24,23.58 | 8.71,23.61 8.7,23.61 | R503.1 8.71,23.61 | 3.83,65.83 3.88,65.78 R521.1 | 7.31,68.8 7.23,68.8 v7.23,71.11 | 7.31,68.8 U521.1 | 28.87,45.13 28.88,45.14 U301.39 | 28.87,45.13 v28.87,49.95 | v59.71,41.65 58.49,42.87 53.56,42.87 v53.25,42.56 | JP301.4 4.99,41.9 4.99,44.93 6.26,46.2 9.82,46.2 9.82,49.34 | U301.6 23.07,39.34 22.65,39.34 | 22.65,39.34 18.81,39.34 17.92,40.23 | 28.87,45.13 28.87,38.27 28.01,37.41 v28.01,36.21 | U301.28 33.1,39.35 31.26,37.51 31.26,36.19 v31.23,36.21 | U301.18 29.68,34.71 31.18,36.21 v31.23,36.21 | v28.01,36.21 28.01,36.19 | v31.23,36.21 31.26,36.21 | R521.1 3.85,65.78 3.83,65.8 3.88,65.85 | 8.22,49.34 8.22,49.32 8.55,48.99 v8.55,47.77 | 22.65,39.34 24.25,39.34 24.81,38.78 v24.81,38.32 | v28.01,36.21 28.03,36.24 | C521.- 19.64,72.52 | 7.31,68.8 4.84,68.8 3.85,67.81 3.85,66.49 R521.1 | 78.68,4.5 78.68,5.3 78.65,5.3 | 78.68,8.83 78.65,8.83 78.65,5.3 | U$98.36 78.65,5.3 | 78.68,4.5 U$98.36 | 78.68,4.5 78.68,9.26 | v78.68,9.24 U$98.36
  Top 0.813: 17.92,40.23 17.92,41.14 17.16,41.9 14.44,41.9 13.66,41.12 13.66,38.12 | 13.66,38.12 13.66,34.82 14.24,34.23 17.54,34.23 17.92,34.61 17.92,35.96 18.58,36.62 v19.68,36.62 | 6.24,38.12 v7.66,38.12 13.66,38.12
  Top 1.143: 34.56,19.02 36.06,19.02 36.08,19.02 39.06,19.02 41.55,19.02 v44.54,19.02 | 48.56,19.02 50.03,19.02 53.03,19.02 53.15,19.02 53.18,19.02 v53.2,19.02 55.44,19.02 58.51,19.02 60.01,19.02 61.23,19.02 62.47,19.02 62.5,19.02 63.97,19.02 64,19.02 66.97,19.02 67,19.02 67.48,19.02 v67.5,19.02 69.51,19.02 72.48,19.02 73.98,19.02 74.21,19.02 80.43,25.24 | 78.68,4.4 78.68,4.16 | 91.08,24.58 91.86,24.58 90.29,26.15 U601.4 | U601.8 80.13,25.54 80.43,25.24 | 80.43,25.24 81.09,24.58 91.08,24.58 | 80.43,25.24 80.33,25.39 | JP301.10 6.26,32.99 6.82,32.43 C503.- | v24.65,21.43 26.32,21.43 C502.- 26.33,24.35 23.26,27.42 C501.- | 34.56,19.02 34.53,19.02 | 34.56,19.02 v34.48,19.02 | 48.56,19.02 48.53,19.02 | 48.56,19.02 v48.5,19.02 | 3.88,65.78 3.88,62.88 3.11,62.12 3.11,57.7 3.6,57.22 4.75,57.22 R512.1 4.74,57.18 4.74,51.76 7.15,49.34 8.22,49.34 9.82,49.34 v14.75,49.34 18.13,49.34 C511.- | U521.1 11.57,68.8 14.95,72.18 C521.- | 78.68,16.15 94.35,16.15 | C521.- | 91.08,24.58 97.93,24.58 99.91,22.6 99.91,17.75 98.31,16.15 94.35,16.15 | 94.35,16.15 94.38,16.15
  Top 1.778: 78.68,4.4 78.68,4.54 78.68,5.3 78.68,8.83 78.68,9.26 v78.68,10.43 v78.68,11.6 78.68,16.15
  Bottom 0.152: 57.17,51.94 57.14,51.96
  Bottom 0.229: C405.1 39.5,19.01 v39.49,18.99 | C404.2 53.27,18.95 v53.2,19.02 | C402.2 67.54,18.98 v67.5,19.02 | C406.2 36.54,15.21 | 55.26,48.15 55.29,48.15 v55.29,49.12 | 58.46,48.15 58.46,48.13 58.49,48.1 59.5,48.1 | 55.29,35.96 55.31,35.96 | 55.31,35.96 55.3,35.97 | 55.32,35.97 55.29,35.93 55.31,35.93 55.31,35.96 | 55.29,34.87 55.31,34.87 v55.31,34.84 | v63.69,34.82 63.69,34.79 63.72,34.82 | 76.17,35.15 76.14,35.15 v76.14,34.94 | 55.29,40.48 55.21,40.48 55.21,41.41 C104.2 | 63.01,48.15 v62.98,48.15 | v68.34,48.07 68.32,48.07 | 68.47,42.97 C106.2 68.51,46.06 68.47,46.09 68.47,46.07 68.34,46.07 68.22,46.07 | 55.29,35.83 55.31,35.83 55.3,35.82 C101.2 | C102.2 60.95,43.48 60.93,43.5 60.79,43.36 | JP301.10 JP301.8 | JP301.4 6.24,40.63 | JP301.6 6.24,38.12 6.24,37.99 | 53.97,51.94 53.97,51.86 53.94,51.88 | 54.5,51.94 54.5,52.19 54.44,52.25 | 13.54,49.28 13.5,49.37 13.55,49.37 | 40.63,56.51 U201.46 40.63,51.94 | C201.2 51.04,54.44 | 57.14,51.96 53.33,51.96 53.33,54.6 U202.46 | 88.48,57.7 88.48,57.68 | U204.27 88.23,57.42 88.48,57.68 | U204.26 88.73,57.43 88.48,57.68 | U203.26 76.03,57.43 75.78,57.68 75.53,57.42 U203.27 | 69.84,51.94 69.84,52.09 | U202.26 63.33,57.35 63.08,57.6 | U202.27 62.83,57.37 63.08,57.63 | U201.26 50.63,57.38 50.38,57.63 | U201.27 50.13,57.4 50.38,57.65 | 78.73,54.73 U204.46 | C203.2 76.34,54.17 | 88.23,56.36 | U204.27 88.23,56.36 | 41.9,51.94 41.9,51.83 | C204.2 87.72,54.53 88.23,55.03 88.23,56.36 | U204.27 88.23,56.41 88.26,56.38 88.23,56.36 | 68.57,51.94 68.57,52.14 66.03,52.14 U203.46 | 78.68,4.41 U$98.36 | 78.68,9.19 78.65,9.19 | v69.28,41.6 69.31,41.6
  Bottom 0.406: 36.54,15.21 36.62,15.28 36.95,15.28 37,15.23 36.97,15.21 C406.2 | C403.2 49.47,15.23 48.91,14.7 48.91,14.17 | 32.93,49.67 32.96,49.67 | C102.2 60.8,43.48 60.8,42.16 | C103.2 60.8,42.16 | 60.93,43.5 60.8,43.38 60.8,42.16 | 60.8,42.16 60.29,41.65 v59.71,41.65 | 55.29,42.56 v53.25,42.56 | J301.WP_2 6.42,71.11 v7.23,71.11 | 28.82,49.88 28.9,49.95 v28.87,49.95 28.87,49.93 28.82,49.88 | v8.55,47.77 9.19,48.4 9.19,52.24 9.2,52.24 J301.8 | v14.75,49.34 14.72,49.37 13.55,49.37 | v24.81,38.32 24.81,36.9 24.55,36.64 | 24.55,36.64 22.11,36.64 | 24.55,36.64 24.58,36.64 24.74,36.81 C301.2 | J301.9 28.53,52.27 30.2,52.27 J301.CARD_DET2 30.23,52.24 30.24,52.24 30.24,49.88 | 32.93,49.57 32.91,49.57 32.58,49.88 30.24,49.88 | 6.24,38.12 v7.66,38.12 | 88.48,58.97 88.48,57.7 | 75.78,57.68 75.78,63.57 75.71,63.64 75.71,65.35 75.73,65.37 | 64.34,52.33 C202.2 | 63.08,57.6 63.08,57.63 63.08,60.5 62.14,61.44 62.14,66.59 | 50.38,57.63 50.38,57.65 50.38,63.72 50.03,64.08 50.03,66.62 | 75.78,51.73 75.64,52.86 76.05,52.86 76.42,53.23 76.42,54.12 76.39,54.15 C203.2 78.2,54.17 78.73,54.73 | 51.04,51.94 51.04,51.99 51.03,52 C201.2 | C311.2 16.13,46.36 16.86,45.64 20.31,45.64 21.02,46.34 J301.3 | J301.6 13.51,52.27 13.5,52.27 13.5,49.37 | 28.82,49.88 30.24,49.88 | U$98.36 78.65,4.54 | U$98.36 | U$98.36 v78.68,9.24 | v61.23,15.23 C401.2
  Bottom 0.813: v19.68,36.62 23.84,36.62
  Bottom 1.016: 76.17,51.35 71.67,52.62 | 60.21,34.82 v60.11,34.82 v56.99,34.82 55.29,34.82 55.29,34.87 55.29,35.83 55.29,35.93 55.29,35.96 v55.29,36.62 55.29,40.48 55.29,42.56 55.29,48.15 v57.29,48.15 58.46,48.15 63.01,48.15 v66.28,48.15 68.47,48.15 72.36,52.04 72.36,51.94 | 60.21,34.82 63.72,34.82 v67,34.82 68.34,34.82 v68.34,36.57 68.34,46.07 v68.34,48.07 | 59.5,48.1 C107.2 | C105.2 61.84,34.82 60.21,34.82 | 31.26,36.21 v31.23,36.21 28.26,36.21 | 28.26,36.21 v28.01,36.21 | C301.2 26.9,36.21 28.26,36.21 | 43.22,51.94 43.22,52.06 43.21,52.07 | 42.5,51.95 41.4,51.95 38.62,54.73 38.62,62.68 42.54,66.62 v43.48,66.62 50.03,66.62 v55.57,66.62 62.14,66.59 62.45,66.29 v68.24,66.29 74.84,66.29 75.73,65.37 82.08,65.37 88.48,58.97 | 65.62,51.94 64.35,52.32 64.34,52.33
  Bottom 1.143: JP301.10 JP301.8 JP301.6 JP301.4 | v24.65,21.43 27.07,19.02 v34.48,19.02 | v48.5,19.02 v44.54,19.02 | 78.3,12.95 78.3,32.76 76.17,34.89 76.17,35.1 v76.14,34.94 | 42.51,51.94 42.5,51.95 | 78.65,4.52 U$98.36 | U$98.36 78.65,4.52 | 78.65,4.52 78.65,4.69
  Bottom 1.778: 78.68,9.14 78.68,9.19 78.68,12.57 78.3,12.95 | 78.68,9.14 78.68,4.53 | 78.68,9.14 U$98.36
  Bottom 2.438: 76.17,35.15 76.17,51.35 75.78,51.73 75.58,51.94 72.36,51.94 69.84,51.94 68.57,51.94 65.62,51.94 57.17,51.94 54.5,51.94 53.97,51.94 51.04,51.94 43.22,51.94 42.51,51.94 41.9,51.94 40.63,51.94 35.3,51.94 32.93,49.57 32.93,49.67
  other vias: 4.74,16.5 8.55,16.5 8.55,12.69 4.74,12.69 86.02,64.76 89.83,64.76 89.83,60.95 40.3,63.49 40.3,68.57 74.59,13.96 82.21,15.23 89.83,15.23 36.49,60.95 36.49,57.14 39.03,54.6 42.71,51.33 79.67,46.98 87.29,46.98 94.91,46.98 83.48,43.17 91.1,42.41 94.91,39.36 87.29,39.36 79.67,39.36 83.48,35.55 91.1,35.55 2.2,63.49 2.2,59.68 2.2,55.87 2.2,52.06 5.38,52.06 2.2,48.25 1.57,29.84 7.92,29.84 26.33,68.57 26.33,64.76 49.22,31.54 86.02,60.95 86.07,12.46 100.65,18.03 97.45,50.79 99.99,49.52 99.99,53.33 99.99,57.14 99.99,60.95 99.99,64.76 36.59,36.03 36.13,30.75 36.59,40.02 40.5,40.02 44.29,40.02 42.41,37.89 31.33,14.04 100.63,12.46 96.71,15.23 49.16,52.06 47.92,48.68 61.26,24.86 93.67,12.46 15.87,71.11 15.87,73.39 14.09,74.92 8.25,74.92 18.61,68.06 18.61,70.09 18.41,74.41 28.41,43.02 69.28,39.82 63.9,43.15 63.9,44.39 54.37,38.3 42.84,78.35 50.46,78.35 58.08,78.35 65.7,78.35 73.32,78.35 24.43,81.27 29.51,81.27 12.36,12.69 16.17,12.69 19.98,12.69 23.16,14.6
  pour Top (isolate 0.305, rank 6): 0.57,11.27 20.72,11.27 20.72,10.86 80.66,10.86 80.66,11.35 101.62,11.35 101.62,66.79 100.09,68.04 100.09,72.69 99.41,73.37 97.73,73.37 97.17,73.93 97.17,75.53 97.75,76.12 99.33,76.12 99.84,76.62 99.84,78.78 99.56,79.06 34.28,79.06 34.28,82.21 5.65,82.21 5.65,79.09 4.94,78.38 4.94,73.5 4.54,73.09 2.89,73.09 2.38,72.59 2.38,68.65 2,68.27 0.85,68.27 0.57,67.99
  pour Bottom (isolate 0.305, rank 6): 4.89,78.45 4.89,73.6 4.33,73.04 2.84,73.04 2.35,72.56 2.35,68.5 2.05,68.19 1.01,68.19 0.7,67.89 0.7,11.32 1.08,10.94 21.89,10.94 80.69,10.97 80.69,11.37 100.78,11.37 101.41,12.01 101.41,68.04 100.85,68.6 100.45,68.6 100.14,68.9 100.14,73.35 99.81,73.68 97.6,73.68 97.37,73.91 97.37,75.46 97.91,75.99 99.53,75.99 99.99,76.45 99.99,78.99 99.74,79.24 33.91,79.24 33.91,82.24 5.41,82.24 5.41,78.97
INIT_B  (via drill 0.6)
  Top 0.229: 28.11,33.52 U301.16 28.08,31.46 v28.31,31.23 | U101.P58 70.83,43.07 v70.63,42.87 | v72.46,28.67 72.46,31.08 v72.18,31.36
  Bottom 0.229: v70.63,42.87 71.03,42.51 71.19,42.51 71.85,41.85 71.85,31.69 v72.18,31.36 | v28.31,31.23 33.75,31.23 36.16,28.82 45.38,28.82 46.88,30.32 70.25,30.32 71.9,28.67 v72.46,28.67 72.48,28.67
IRQ_DIR  (via drill 0.6)
  Top 0.229: v31.84,23.97 30.88,23 30.88,17.26 32.85,15.29 U403.1 | v74.87,23.08 74.87,32.81 73.63,34.05 72.41,34.05 72.4,34.06 | 72.4,34.06 72.38,34.08 | 72.4,34.06 U101.P40
  Bottom 0.229: v31.84,23.97 31.92,24.05 47.56,24.05 47.82,23.79 74.16,23.79 v74.87,23.08
MISO  (via drill 0.6)
  Top 0.229: U301.2 25.89,42.55 v26.28,42.16 26.31,42.13 26.31,36.72 23.89,34.31 23.41,34.31 20.51,31.41 14.57,31.41 11.75,34.23 4.94,34.23 JP301.9 | U101.P123 | U101.P123 | v41.93,42.33 42.66,43.07 U101.P123
  Bottom 0.229: v26.28,42.16 26.61,41.83 41.42,41.83 v41.93,42.33 | 3.78,32.99 3.75,32.99 JP301.9 3.72,33.88 2.58,35.02 2.58,45.38 3.67,46.47 10.66,46.47 11.27,47.08 J301.7
MOSI  (via drill 0.6)
  Top 0.229: v25.09,43.4 23.49,43.4 | 23.49,43.4 23.1,43.4 | U101.P122 51.17,43.55 | U101.P122 | v40.55,42.79 41.32,43.55 U101.P122 | 23.11,43.38 23.16,43.38 | 23.11,43.38 U301.1 | 23.11,43.38 23.08,43.38 22.98,43.38 23.36,43.76 23.49,43.76 23.49,43.4
  Top 0.406: 23.54,45.99 v23.54,46.22 23.54,43.83 23.08,43.38
  Bottom 0.229: v40.55,42.79 40.1,42.33 27.6,42.33 26.53,43.4 v25.09,43.4 13.73,43.4 12.74,44.39 5.35,44.39 4.13,43.17 JP301.1
  Bottom 0.406: 23.54,52.27 23.54,52.29 | 23.54,52.27 J301.2 | v23.54,46.22 23.54,52.27
N$1  (via drill 0.6)
  Top 0.229: v75.71,26.81 77.56,28.67 77.56,29.96 78.98,31.39 94.76,31.39 U601.1 | v32.17,28.29 31.94,28.06 31.94,26.26 29.73,24.05 29.73,10.84 v30.78,9.8 30.78,9.77
  Bottom 0.229: 32.15,28.29 v32.17,28.29 33.37,28.29 34.41,27.25 46.19,27.25 47.74,28.8 69.61,28.8 72.08,26.33 75.2,26.33 75.68,26.81 v75.71,26.81 | v30.78,9.8 30.78,4.49 30.89,4.49 30.89,4.46 30.9,4.46 | 30.9,4.46 | U$98.24 30.9,4.46
N$2  (via drill 0.6)
  Top 0.229: v75.76,25.34 78.04,27.63 78.04,29.79 79.19,30.93 92.68,30.93 U601.2 | v33.06,27.27 32.66,26.87 32.66,25.95 30.34,23.64 30.34,11.27 31.89,9.72 31.89,8.45 30.9,7.46 30.9,4.46 | 30.9,4.46 U$98.55 | 30.9,4.46 30.9,4.21
  Bottom 0.229: v33.06,27.27 33.04,27.27 33.52,26.79 46.45,26.79 47.97,28.31 69.36,28.31 72.3,25.37 75.78,25.37 v75.76,25.34
N$3  (via drill 0.6)
  Top 0.229: v76.83,24.45 78.53,26.15 78.53,29.61 79.39,30.47 83,30.47 85.23,28.24 U601.6 | v31.08,26.81 28.97,24.71 28.97,10.41 29.23,10.15 29.23,8.98 28.36,8.12 28.36,4.51 | U$98.56 28.36,4.51 | 28.36,4.51 28.36,4.44
  Bottom 0.229: v31.08,26.81 31.59,26.31 46.68,26.31 48.23,27.86 69.08,27.86 72.1,24.83 75.17,24.83 75.48,24.53 76.75,24.53 v76.83,24.45
N$4  (via drill 0.6)
  Top 0.229: v76.22,23.08 76.55,23.08 78.98,25.52 78.98,29.41 79.59,30.02 80.89,30.02 U601.7 | v29.45,26.64 28.36,25.54 v28.36,9.8
  Bottom 0.229: v29.45,26.64 30.29,25.8 46.96,25.8 48.56,27.4 68.85,27.4 71.97,24.27 75.02,24.27 v76.22,23.08 | 28.36,4.49 v28.36,9.8 | 28.4,4.49 28.41,4.49 | U$98.25 28.4,4.49 | 28.36,4.49 28.36,4.18 | 28.4,4.49 28.36,4.49
N$5
  Top 0.406: 15.56,40.63 15.54,40.66 | X301.2 15.56,40.63 | U301.7 17.65,38.55 15.56,40.63
  Bottom 0.406: 15.66,40.66 X301.2 15.64,40.63 | 15.64,40.63 15.61,40.66 | C302.2 15.94,40.33 15.64,40.63
N$6
  Top 0.406: X301.1 15.66,35.58 17.83,37.75 U301.8
  Bottom 0.406: X301.1 15.64,35.55 18.38,38.3 C303.2
N$7
  Bottom 0.229: 37.25,71.16 LED311.A
  Bottom 0.406: 37.15,70.86 37.18,70.83 37.25,70.91 37.25,71.16 R311.2 | LED311.A 37.25,72.99
N$8
  Top 0.229: 23.09,40.94 23.16,40.94 | 23.09,40.94 U301.4 | 22.42,40.94 22.37,40.94 | 22.42,40.94 23.09,40.94 | 22.42,40.94 21.4,40.94 20.77,41.57 20.77,42.72 19.29,44.19 13.71,44.19 12.94,43.43 12.94,40.48 11.88,39.41 10.19,39.41 R313.1 9.74,39.82 9.34,39.41 5.02,39.41 3.7,38.09 JP301.5
  Bottom 0.229: JP302.1 4.99,24.88 4.99,29.84 | JP301.5 4.99,36.82 4.99,29.84 | 4.99,29.84 4.99,30.44 C304.1 4.99,29.84
N$9
  Bottom 0.229: 35.22,70.88 R312.1 LED312.A
N$10
  Top 0.229: U403.3 | U403.2 U403.3 | U403.3 35.58,15.31 | U403.5 U403.6 37.05,15.26 37.07,15.23 37.05,15.21 37.05,14.47 | U403.2 | U403.2 35.09,15.33 | R401.2 33.96,11.69 33.98,11.68 35.04,12.74 35.05,12.75 35.05,13.1 | 35.05,13.1 U403.2 | 38.04,14.19 38.55,14.19 | 38.55,14.19 39.28,14.19 39.56,14.47 39.56,15.36 39.55,15.35 U403.11 | U403.8 38.05,14.2 38.04,14.19 | U403.9 38.55,14.19 | 38.04,14.19 37.33,14.19 37.05,14.47 | 37.05,14.47 37.05,13.86 36.29,13.1 35.05,13.1
N$11  (via drill 0.6)
  Top 0.229: U301.40 28.08,48.68 v28.08,48.66
  Bottom 0.229: LED312.C 35.22,75 | LED312.C 35.22,74.87 | 35.24,74.93 35.25,74.92 | LED312.C 35.24,74.93 | 35.24,74.93 35.22,74.95 | v28.08,48.66 28.08,50.77 27.63,51.22 27.63,53.94 28.08,54.37 29.43,54.37 34.08,59.05 34.08,73.96 35.12,75 35.19,74.93 LED312.C
N$12
  Top 0.229: U403.47 35.05,23.47 35.25,23.67 35.55,23.67 | 35.55,23.67 36.54,23.67 | 36.54,23.67 37.07,23.67 | 37.07,23.67 37.84,23.67 | 37.84,23.67 38.04,23.67 | 38.04,23.67 38.55,23.67 | 38.55,23.67 39.36,23.67 39.54,23.49 39.54,22.83 39.56,22.8 U403.38 | U403.46 35.55,23.59 35.55,23.67 | U403.44 36.55,23.58 36.54,23.67 | U403.43 37.05,23.59 37.07,23.67 | U403.41 38.05,23.58 38.04,23.67 | U403.40 38.55,23.59 38.55,23.67 | R402.2 38.01,23.84 37.84,23.67
N$13  (via drill 0.6)
  Top 0.229: U301.37 30.48,46.71 v30.8,47.03
  Bottom 0.229: v30.8,47.03 27.75,47.03 24.78,50.01 24.78,58.84 23.97,59.66 17.77,59.66 17.21,60.22 17.21,73.8 14.98,76.04 6.4,76.04 | 6.4,76.04 6.37,76.04 | 6.4,76.04 J301.WP_1
N$14  (via drill 0.6)
  Top 0.229: U301.43 25.68,48.14 v26.99,49.45
  Bottom 0.229: 37.23,74.91 37.23,74.9 | 37.23,74.91 LED311.C | 37.23,74.91 37.23,75.33 36.44,76.12 34.2,76.12 33.47,75.38 33.47,59.25 29.1,54.88 27.78,54.88 26.99,54.09 v26.99,49.45
N$107
  Top 0.406: 6.81,58.92 6.9,58.92 | 6.9,58.92 6.98,58.92 | 6.81,58.92 R511.1 | R512.2 4.78,58.92 6.81,58.92 | 6.7,58.95 6.76,58.95 R511.1 | U511.1 9.21,59.23 7.2,59.23 6.9,58.92 | 6.9,58.92 6.89,58.91 R511.1
N$108
  Top 0.406: 11.28,21.89 11.29,21.89 | 11.28,21.89 R502.2 13.8,21.91 R501.1 13.78,21.93 13.78,21.94 14.34,21.94 U501.1 | 11.28,21.89 8.74,21.89 R503.2 8.71,21.89 7.51,21.89 7.08,22.32 7.08,27.09 7.49,27.51 C503.+ 8.42,27.15 7.23,27.15
  Top 1.143: R501.1 13.83,21.88
PROG_B  (via drill 0.6)
  Top 0.229: U101.P143 v49.22,33.06
  Bottom 0.229: R302.1 46.83,32.1 47.79,33.06 v49.22,33.06
PROG_B_AVR  (via drill 0.6)
  Top 0.229: U301.12 24.88,32.56 v24.43,32.1
  Bottom 0.229: 41.9,32.1 R302.2 v24.43,32.1
RESET_DIR  (via drill 0.6)
  Top 0.229: U402.1 48.52,17.45 47.54,18.43 47.54,23.64 v48.63,24.73 | U301.14 26.51,33.52 26.48,33.5 v26.48,28.08
  Bottom 0.229: v48.63,24.73 29.38,24.73 26.48,27.63 v26.48,28.08
RXD  (via drill 0.6)
  Top 0.229: v19.24,35.27 19.83,35.27 21.5,36.95 U301.9 | v76.37,32.78 77.21,32.78 88.87,44.44 96.82,44.44 97.45,45.08 98.47,45.08 98.47,45.1 JP303.2
  Top 0.406: U301.9
  Bottom 0.229: v76.37,32.78 74.18,30.6 71.49,30.6 70.27,31.82 52.42,31.82 51.6,32.63 51.6,33.5 50.66,34.43 20.08,34.43 v19.24,35.27
SCK  (via drill 0.6)
  Top 0.229: v25.06,41.29 24.61,41.75 U301.3 21.91,41.75 21.48,42.18 21.48,42.77 18.84,45.41 v14.7,45.41 | U101.P124 | v43.22,41.65 44.14,42.56 U101.P124 | JP301.7 2.53,36.75 2.53,44.21 v3.75,45.41
  Bottom 0.229: v25.06,41.29 42.87,41.29 v43.22,41.65 | v3.75,45.41 v14.7,45.41 14.7,48.05 15.08,48.43 15.61,48.43 16.02,48.84 J301.5
SD_DET  (via drill 0.6)
  Top 0.229: v2.38,34.23 4.13,34.23 4.99,35.1 4.99,36.37 5.45,36.82 7.08,36.82 8.09,35.81 10.81,35.81 14.77,31.87 20.16,31.87 21.73,33.44 21.73,34.99 22.09,35.35 U301.11 | U301.11 23.18,35.35 | U301.11
  Bottom 0.229: J301.CARD_DET1 7.17,47.63 6.59,47.06 3.39,47.06 2.1,45.76 2.1,34.51 v2.38,34.23
SD_SS  (via drill 0.6)
  Top 0.406: U301.44 24.88,49.8 v25.8,50.72
  Bottom 0.406: v25.8,50.72 26.03,50.94 J301.1
SNES_/IRQ  (via drill 0.3)
  Top 0.229: U403.37 40.05,34.64 40.55,35.15 v40.55,35.5 | U101.P55 v71.01,41.57
  Bottom 0.229: v40.55,35.5 51.02,35.5 52.54,33.98 52.54,33.06 52.87,32.73 70.15,32.73 70.4,32.99 70.4,34.99 71.01,35.6 v71.01,41.57
SNES_/IRQ_EXT  (via drill 0.6)
  Top 0.229: U403.12 40.05,15.24 40.02,15.21 40.02,13.86 v37.58,11.57
  Bottom 0.229: 45.86,4.54 45.86,9.72 44.01,11.57 v37.58,11.57 | 45.86,4.54 | U$98.18 45.9,4.54 45.86,4.54
SNES_/RD
  Top 0.229: U101.P2 53.51,30.59 53.51,29.56 51.02,27.07 U402.43 | U402.43 51.02,22.55 | U402.43
SNES_/RD_EXT  (via drill 0.6)
  Top 0.229: v47.79,12.97 49.72,12.97 51.02,14.27 51.02,15.26 U402.6
  Bottom 0.229: U$98.23 33.4,4.41 33.39,4.41 33.39,4.51 33.37,4.51 33.37,7.94 32.35,8.96 32.35,9.95 34.33,11.93 36.31,11.93 37.18,12.79 42.31,12.79 42.97,13.45 47.29,13.45 47.77,12.97 47.79,13 v47.79,12.97
SNES_/RESET  (via drill 0.6)
  Top 0.229: U402.44 50.52,25.87 v49.93,26.46 | 27.3,33.56 27.3,33.77 | 27.3,33.56 U301.15 | 27.93,28.08 27.96,28.06 | v27.91,28.08 27.93,28.08 | 27.3,33.56 27.3,28.72 27.93,28.08
  Bottom 0.229: v49.93,26.46 48.53,26.46 47.39,25.32 29.53,25.32 27.93,26.92 27.93,28.06 v27.91,28.08
SNES_/RESET_EXT  (via drill 0.6)
  Top 0.229: 46.83,14.32 46.8,14.32 | v46.85,14.34 46.83,14.32 | 46.83,14.32 47.56,14.32 48.12,13.76 49.85,13.76 50.54,14.45 50.54,15.28 U402.5
  Bottom 0.229: U$98.26 25.95,4.54 25.9,4.59 | 25.9,4.59 25.9,8.48 29.96,12.54 36.31,12.54 37.13,13.35 42.18,13.35 43.17,14.34 46.83,14.34 46.83,14.32 v46.85,14.34 | 25.9,4.56 25.87,4.56 | 25.9,4.56 25.9,4.59 | U$98.26 25.9,4.56
SNES_/ROMSEL
  Top 0.229: U101.P5 54.98,28.57 52.52,26.1 U402.40 | U402.40 52.52,22.78 | U402.40
SNES_/ROMSEL_EXT
  Top 0.229: 45.89,4.56 45.9,4.55 | 45.89,4.56 45.91,4.59 45.91,10.03 47.54,11.65 50.03,11.65 52.49,14.11 52.49,15.31 52.51,15.29 U402.9 | 45.89,4.56 45.89,4.51 U$98.49
SNES_/WR
  Top 0.229: U402.41 52.04,22.81 52.04,26.36 54.47,28.8 54.47,30.6 U101.P4
SNES_/WR_EXT  (via drill 0.6)
  Top 0.229: 33.37,4.49 33.38,4.5 33.38,4.49 33.37,4.49 | 33.37,4.49 v33.34,9.29 | 33.37,4.49 33.4,4.49 U$98.54 | v46.47,12.51 47.11,12.51 47.39,12.24 49.83,12.24 52.01,14.42 52.01,15.28 U402.8
  Bottom 0.229: v33.34,9.29 33.39,9.24 33.39,10.25 34.43,11.3 36.29,11.3 37.28,12.29 42.87,12.29 43.09,12.51 v46.47,12.51 46.5,12.54
SNES_A0
  Top 0.229: U101.P7 55.97,30.6 55.97,27.88 54.02,25.93 U402.37 | U402.37 54.02,22.67 | U402.37
SNES_A0_EXT  (via drill 0.6)
  Top 0.229: U402.12 54.02,13.92 49.37,9.26 49.24,9.26 v49.22,9.24
  Bottom 0.229: 48.45,4.54 48.44,4.54 | v49.22,9.24 48.45,8.48 48.45,4.54 | U$98.17 48.45,4.51 48.45,4.54
SNES_A1
  Top 0.229: U402.35 55.01,22.81 55.01,25.29 57.47,27.75 57.47,30.63 | 57.47,30.63 57.47,30.75 | 57.47,30.63 U101.P10
SNES_A1_EXT  (via drill 0.6)
  Top 0.229: v51.43,9.24 51.43,9.62 55.01,13.2 55.01,15.28 U402.14
  Bottom 0.229: v51.43,9.24 51.43,8.78 50.89,8.25 50.89,4.64 50.92,4.62 50.9,4.6 50.9,4.59 | U$98.16 50.9,4.59 | 50.9,4.59 50.89,4.59
SNES_A2
  Top 0.229: U402.32 56.53,22.8 56.53,25.11 58.49,27.07 U101.P12 | U101.P12 58.49,30.78 | U101.P12
SNES_A2_EXT  (via drill 0.6)
  Top 0.229: U402.17 56.51,15.28 56.51,12.31 v53.43,9.24
  Bottom 0.229: v53.43,9.24 53.43,4.59 53.4,4.56 53.4,4.54 | U$98.15 53.4,4.54 | 53.4,4.54 53.43,4.54
SNES_A3
  Top 0.229: U402.29 58,22.81 58,24.88 59.48,26.36 59.48,30.6 U101.P14
SNES_A3_EXT  (via drill 0.6)
  Top 0.229: U402.20 58.02,12.2 55.92,10.1 55.92,9.14 55.9,9.16 v55.9,9.24
  Bottom 0.229: U$98.14 55.87,4.54 55.9,4.56 | 55.9,4.56 v55.9,9.24 | U$98.14 55.9,4.56
SNES_A4
  Top 0.229: U402.26 59.5,22.81 59.5,24.66 60.98,26.13 60.98,30.62 | 60.98,30.62 | 60.98,30.62 U101.P17
SNES_A4_EXT  (via drill 0.6)
  Top 0.229: U402.23 59.52,10.37 v58.39,9.24
  Bottom 0.229: 58.4,9.22 v58.39,9.24 58.39,4.5 U$98.13
SNES_A5
  Top 0.229: U401.46 63.49,24.94 62.47,25.95 62.47,30.52 62.49,30.54 U101.P20
SNES_A5_EXT  (via drill 0.6)
  Top 0.229: v60.9,9.24 60.9,10.89 63.49,13.48 63.49,15.23 | 63.49,15.23 | 63.49,15.23 U401.3
  Bottom 0.229: v60.9,9.24 U$98.12
SNES_A6
  Top 0.229: 64,30.6 U101.P23 63.99,30.54 64,30.52 63.97,30.5 63.97,25.95 64.99,24.93 U401.43
SNES_A6_EXT  (via drill 0.6)
  Top 0.229: v63.39,9.24 62.96,9.67 62.96,11.24 64.99,13.28 U401.6 | U401.6 64.99,15.31 | U401.6
  Bottom 0.229: v63.39,9.24 63.4,9.23 63.4,4.54 | U$98.11 63.4,4.54 | 63.4,4.54 63.39,4.54
SNES_A7
  Top 0.229: U401.40 66.49,24.86 64.99,26.36 64.99,30.5 U101.P25
SNES_A7_EXT  (via drill 0.6)
  Top 0.229: U401.9 66.49,9.82 v65.9,9.24
  Bottom 0.229: v65.9,9.23 v65.9,9.24 65.9,9.26 U$98.10
SNES_A8
  Top 0.229: U401.37 67.99,24.88 65.98,26.89 65.98,30.55 65.99,30.56 U101.P27
SNES_A8_EXT  (via drill 0.6)
  Top 0.229: v68.39,9.24 68.39,9.21 67.99,9.62 U401.12
  Bottom 0.229: 68.4,9.23 v68.39,9.24 68.39,9.26 68.4,9.26 U$98.9
SNES_A9
  Top 0.229: U101.P30 67.49,26.68 69,25.16 69,22.88 69.03,22.85 68.99,22.82 U401.35
SNES_A9_EXT  (via drill 0.6)
  Top 0.229: v70.91,9.24 70.88,11.37 68.99,13.26 U401.14
  Bottom 0.229: U$98.8 | U$98.8 v70.91,9.24 | U$98.8 | U$98.8 | U$98.8 70.88,4.51
SNES_A10
  Top 0.229: U101.P32 68.49,27.15 70.48,25.16 70.48,22.8 U401.32
SNES_A10_EXT  (via drill 0.6)
  Top 0.229: U401.17 70.49,13.52 73.4,10.61 v73.4,9.21 73.4,9.16
  Bottom 0.229: 73.4,4.62 73.4,4.61 | 73.4,4.62 v73.4,9.21 | 73.4,4.56 73.4,4.62 | U$98.7 73.4,4.56 | 73.4,4.56 73.42,4.56
SNES_A11
  Top 0.229: U101.P35 69.99,27.18 72,25.16 72,22.85 71.99,22.84 U401.29
SNES_A11_EXT  (via drill 0.6)
  Top 0.229: v75.89,9.24 75.89,10.69 | 75.89,10.69 75.89,10.71 | U401.20 71.99,14.58 75.89,10.69
  Bottom 0.229: 75.92,5.29 75.84,4.51 75.89,4.56 | 75.89,4.56 v75.89,9.24 | 75.89,4.56 75.89,4.51 U$98.6
SNES_A12
  Top 0.229: U101.P33 68.99,27.39 71.49,24.88 71.49,22.75 U401.30
SNES_A12_EXT
  Top 0.229: 75.89,7.87 75,8.76 75,10.51 71.49,14.01 U401.19 | 75.89,7.87 75.9,7.85 75.9,7.87 | U$98.37 75.9,7.87 | 75.9,7.87 75.89,7.87
SNES_A13
  Top 0.229: U101.P31 67.99,26.94 69.99,24.94 69.99,22.83 69.99,22.82 U401.33
SNES_A13_EXT
  Top 0.229: 73.4,7.87 73.4,7.86 73.4,7.87 | U$98.38 | U$98.38 73.4,4.46 | U$98.38 73.4,7.74 | 73.4,7.74 73.4,7.87 | U401.16 69.99,13.15 71.97,11.17 71.97,9.19 73.42,7.74 73.4,7.74
SNES_A14
  Top 0.229: U101.P28 66.49,27.02 68.52,24.99 68.52,22.7 68.49,22.73 U401.36
SNES_A14_EXT
  Top 0.229: 70.91,4.59 70.9,4.58 | 70.88,7.76 70.88,4.62 70.91,4.59 | 70.88,7.76 70.88,7.79 | 70.91,4.59 70.91,4.49 70.9,4.49 U$98.39 | 70.88,7.76 70.91,7.76 70.91,7.87 69.84,8.93 69.84,11.55 68.49,12.9 68.49,15.26 U401.13
SNES_A15
  Top 0.229: U401.38 67.49,24.59 65.5,26.59 65.5,30.52 65.49,30.53 U101.P26
SNES_A15_EXT
  Top 0.229: 68.37,7.82 68.37,4.56 68.39,4.54 | 68.37,7.82 68.37,7.84 | 68.4,4.53 68.39,4.54 | U$98.40 68.4,4.53 | 68.4,4.53 68.4,4.54 68.39,4.54 | 68.37,7.82 68.39,7.82 67.49,8.72 U401.11
SNES_A16